# Altium schematic sheet MainPCB.SchDoc: Main PCB
size A4; DrawnBy: Charith Janaka; Engineer: Charith Janaka; Revision: 1; SheetNumber: 1; SheetTotal: 1
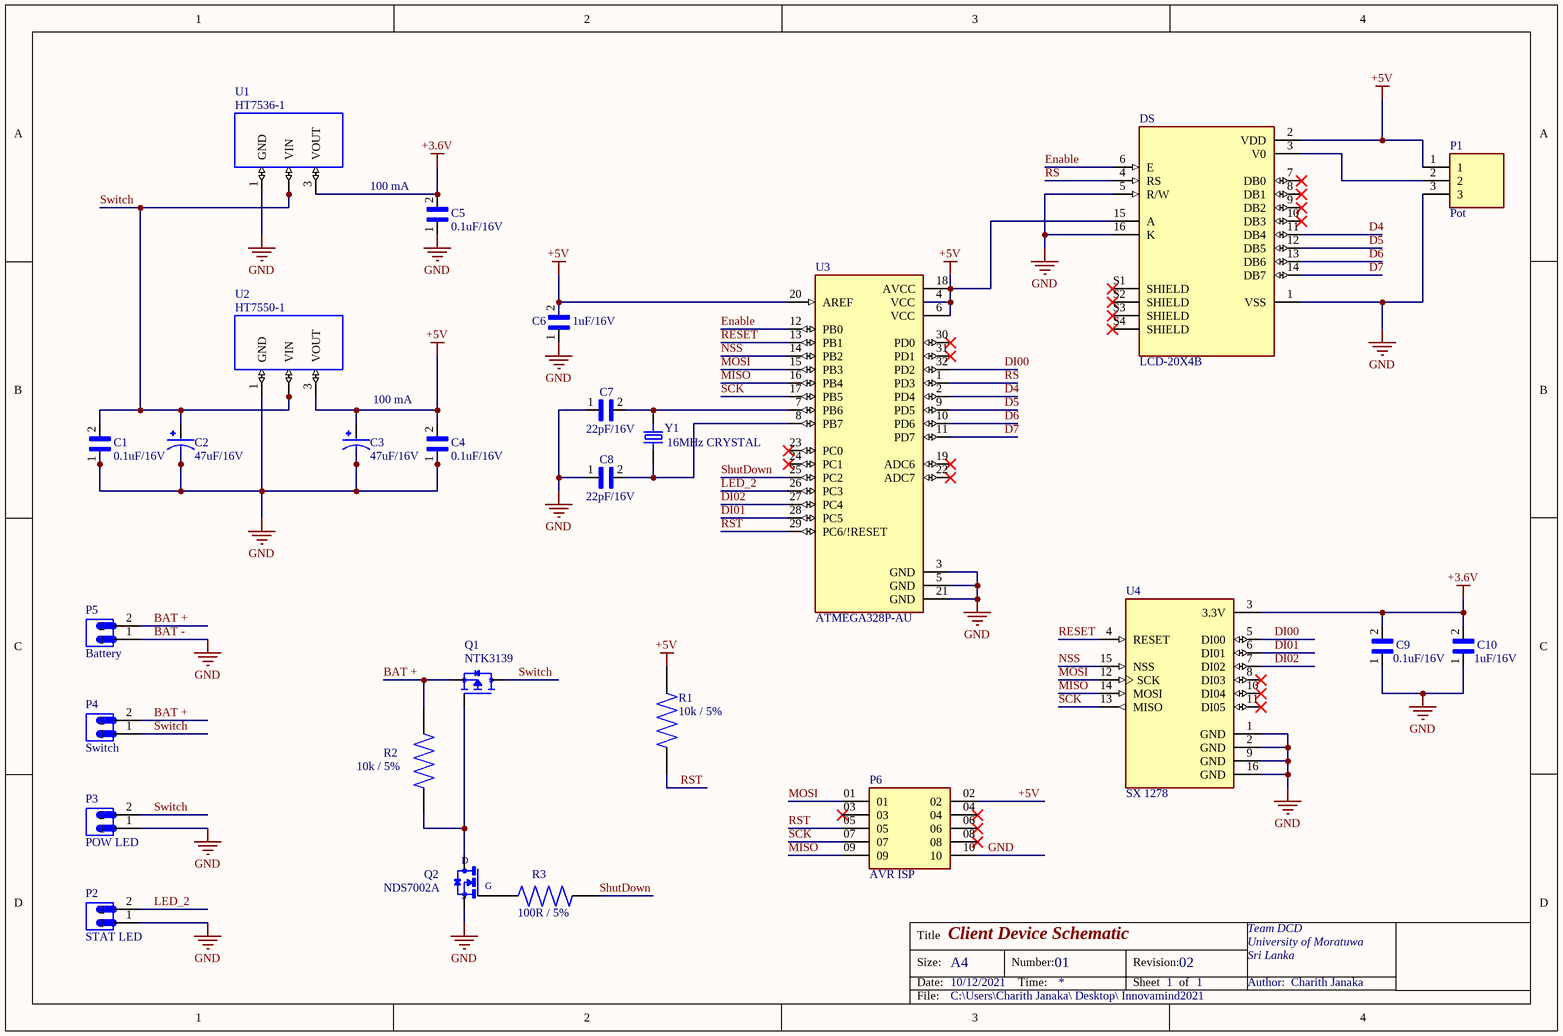
[diagram p0: MainPCB.SchDoc]

## Parts
C1  0.1uF/16V  [CAPC3216X110N]
C2  47uF/16V  [CAP_EEEFC0J470AR]
C3  47uF/16V  [CAP_EEEFC0J470AR]
C4  0.1uF/16V  [CAPC3216X110N]
C5  0.1uF/16V  [CAPC3216X110N]
C6  1uF/16V  [CAPC3316X120N]
C7  22pF/16V  [CAPC3216X88N]
C8  22pF/16V  [CAPC3216X88N]
C9  0.1uF/16V  [CAPC3216X110N]
C10  1uF/16V  [CAPC3316X120N]
DS  LCD-20X4B  [LCD_LCD-20X4B]
P1  Pot  [JST_S3B-XH-A(LF)(SN)]
P2  STAT LED  [JST_S2B-XH-A(LF)(SN)]
P3  POW LED  [JST_S2B-XH-A(LF)(SN)]
P4  Switch  [JST_S2B-XH-A(LF)(SN)]
P5  Battery  [JST_S2B-XH-A(LF)(SN)]
P6  AVR ISP  [SAMTEC_TSW-105-05-L-D]
Q1  NTK3139  [SOT40P120X55-3N]
Q2  NDS7002A  [SOT23]
R1  10k / 5%  [RESC3115X65N]
R2  10k / 5%  [RESC3115X65N]
R3  100R / 5%  [RESC3115X65N]
U1  HT7536-1  [SOT89]
U2  HT7550-1  [SOT89]
U3  ATMEGA328P-AU  [QFP80P900X900X120-32N]
U4  SX 1278  [MODULE_RA-02_LORA]
Y1  16MHz CRYSTAL  [XTAL_ECS-160-20-5PVX]

## Nets
+3.6V: C5.2 C9.2 C10.2 U1.3(VOUT) U4.3(3.3V)
+5V: C3.1 C4.2 C6.2 DS.2(VDD) DS.15(A) P1.1 P6.02 R1.1 U2.3(VOUT) U3.4(VCC) U3.6(VCC) U3.18(AVCC) U3.20(AREF)
BAT -: C1.1 C2.2 C3.2 C4.1 C5.1 C6.1 C7.1 C8.1 C9.1 C10.1 DS.1(VSS) DS.5(R/W) DS.16(K) P1.3 P2.1 P3.1 P5.1 P6.10 Q2.2(S) U1.1(GND) U2.1(GND) U3.3(GND) U3.5(GND) U3.21(GND) U4.1(GND) U4.2(GND) U4.9(GND) U4.16(GND)  [also labelled GND]
BAT +: P4.2 P5.2 Q1.2(S) R2.2
D4: DS.11(DB4) U3.2(PD4)
D5: DS.12(DB5) U3.9(PD5)
D6: DS.13(DB6) U3.10(PD6)
D7: DS.14(DB7) U3.11(PD7)
DI00: U3.32(PD2) U4.5(DI00)
DI01: U3.28(PC5) U4.6(DI01)
DI02: U3.27(PC4) U4.7(DI02)
Enable: DS.6(E) U3.12(PB0)
LED_2: P2.2 U3.26(PC3)
MISO: P6.09 U3.16(PB4) U4.14(MOSI)
MOSI: P6.01 U3.15(PB3) U4.12(SCK)
NSS: U3.14(PB2) U4.15(NSS)
RESET: U3.13(PB1) U4.4(RESET)
RS: DS.4(RS) U3.1(PD3)
RST: P6.05 R1.2 U3.29(PC6/!RESET)
SCK: P6.07 U3.17(PB5) U4.13(MISO)
ShutDown: R3.2 U3.25(PC2)
Switch: C1.2 C2.1 P3.2 P4.1 Q1.3(D) U1.2(VIN) U1.2@1(VIN) U2.2(VIN) U2.2@1(VIN)
NetC7_2: C7.2 U3.7(PB6) Y1.2
NetC8_2: C8.2 U3.8(PB7) Y1.1
NetDS_3: DS.3(V0) P1.2
NetQ1_1: Q1.1(G) Q2.3(D) R2.1
NetQ2_1: Q2.1(G) R3.1

Not connected (* = marked no-connect by the designer): DS 7(DB0)* 8(DB1)* 9(DB2)* 10(DB3)* S1(SHIELD)* S2(SHIELD)* S3(SHIELD)* S4(SHIELD)*; P6 03* 04* 06* 08*; U3 19(ADC6)* 22(ADC7)* 23(PC0)* 24(PC1)* 30(PD0)* 31(PD1)*; U4 8(DI03)* 10(DI04)* 11(DI05)*

## Notes on the sheet
- (near C5) 100 mA
- 100 mA
- Title
- Size:
- Date:
- Client Device Schematic
- 10/12/2021
- A4
- Number:
- Time:
- 01
- Revision:
- Sheet
- 1
- 02
- of
- Team DCD
- University of Moratuwa
- Sri Lanka
- Author:  Charith Janaka
- File:
- C:\Users\Charith Janaka\ Desktop\ Innovamind2021

## Library data of the parts
C1 C4 C5 C9 = C1206F104K4RACAUTO: Package: None; Price: None; Value: *; MP: C1206F104K4RACAUTO; Availability: Unavailable
C2 C3 = EEEFC0J470AR: Cap Aluminum Lytic 47uF 6.3V 20% (5 X 5.4mm) SMD 95mA 1000h 105C Automotive T/R; MF: Panasonic; Package: RADIAL-2 Panasonic; MP: EEEFC0J470AR; Purchase-URL: https://pricing.snapeda.com/search/part/EEEFC0J470AR/?ref=eda; SnapEDA_Link: https://www.snapeda.com/parts/EEEFC0J470AR/Panasonic/view-part/5794427/?ref=snap; Check_prices: https://www.snapeda.com/parts/EEEFC0J470AR/Panasonic/view-part/5794427/?ref=eda; Price: None; Value: *; Availability: In Stock
C6 C10 = C1206X105J4RECAUTO: Package: None; Price: None; Value: *; MP: C1206X105J4RECAUTO; Availability: Unavailable
C7 C8 = C1206C220F4HACAUTO: Package: None; Price: None; Value: *; MP: C1206C220F4HACAUTO; Availability: Unavailable
DS = LCD-20X4B: Display Development Tools 20X4 CHARACTER BLUE LCD W/BACKLIGHT; MF: Gravitech; Price: None; Value: *; Availability: Unavailable; Mouser-Purchase-URL: https://snapeda.com/shop?store=Mouser&id=833821; SnapEDA_Link: https://www.snapeda.com/parts/LCD-20X4B/Gravitech/view-part/833821/?ref=snap; MP: LCD-20X4B; Package: None
P1 = S3B-XH-A(LF)(SN): Connector Header Through Hole, Right Angle 3 position 0.098 _2.50mm_; MP: S3B-XH-A_LF__SN_; MF: JST Sales; SnapEDA_Link: https://www.snapeda.com/parts/S3B-XH-A%28LF%29%28SN%29/JST%20Sales%20America%20Inc./view-part/46873/?ref=snap; Availability: Unavailable; Package: FakePackage u; Value: *; Price: None
P2-P5 = S2B-XH-A(LF)(SN): Connector Header Through Hole, Right Angle 2 position 0.098 _2.50mm_; MP: S2B-XH-A_LF__SN_; MF: JST Sales; Digi-Key_Part_Number: 455-2257-ND; Package: None; Digi-Key_Purchase_URL: https://www.digikey.com/product-detail/en/jst-sales-america-inc/S2B-XH-A_LF__SN_/455-2257-ND/1651055?utm_source=snapeda&utm_medium=aggregator&utm_campaign=symbol; Value: *; SnapEDA_Link: https://www.snapeda.com/parts/S2B-XH-A%28LF%29%28SN%29/JST%20Sales%20America%20Inc./view-part/46871/?ref=snap
P6 = TSW-105-05-L-D: Package: None; Price: None; Value: *; MP: TSW-105-05-L-D; Availability: Unavailable
Q1 = NTK3139PT1G: P-Channel 20V 660mA (Ta) 310mW (Ta) Surface Mount SOT-723; MF: ON Semiconductor; SnapEDA_Link: https://www.snapeda.com/parts/NTK3139PT1G/ON%20Semiconductor/view-part/302649/?ref=snap; Mouser-Purchase-URL: https://snapeda.com/shop?store=Mouser&id=302649; Arrow_Europe-Purchase-URL: https://snapeda.com/shop?store=Arrow+Europe&id=302649; Value: *; Availability: Good; MP: NTK3139PT1G; Price: None; Package: SOT-723 ON Semiconductor; Arrow_Electronics-Purchase-URL: https://snapeda.com/shop?store=Arrow+Electronics&id=302649
Q2 = NDS7002A: N-Channel 60V 280mA _Ta_ 300mW _Ta_ Surface Mount SOT-23 _TO-236AB_; MF: ON Semiconductor; MP: NDS7002A; Availability: Unavailable; SnapEDA_Link: https://www.snapeda.com/parts/NDS7002A/ON%20Semiconductor/view-part/2657545/?ref=snap; Package: SOT-23-3 ON Semiconductor; Price: None; Value: *
R1 = CRGCQ1206J10K: MF: TE Connectivity; DigiKey-Purchase-URL: https://snapeda.com/shop?store=DigiKey&id=3188341; Mouser-Purchase-URL: https://snapeda.com/shop?store=Mouser&id=3188341; Value: *; SnapEDA_Link: https://www.snapeda.com/parts/CRGCQ1206J10K/TE%20Connectivity/view-part/3188341/?ref=snap; Availability: Warning; Price: None; Package: 3115 TE Connectivity; MP: CRGCQ1206J10K
R2 = CRGCQ1206J10K: Fixed Resistor CRGCQ 1206 10K 5%; MF: TE Connectivity; DigiKey-Purchase-URL: https://snapeda.com/shop?store=DigiKey&id=3188341; Mouser-Purchase-URL: https://snapeda.com/shop?store=Mouser&id=3188341; Value: *; SnapEDA_Link: https://www.snapeda.com/parts/CRGCQ1206J10K/TE%20Connectivity/view-part/3188341/?ref=snap; Availability: Warning; Price: None; Package: 3115 TE Connectivity; MP: CRGCQ1206J10K
R3 = CRGCQ1206J100R: Fixed Resistor CRGCQ 1206 100R 5%; Package: None; Price: None; Value: *; MP: CRGCQ1206J100R; Availability: Unavailable
U1 U2 = HT7550-1: Voltage stabiliser; LDO, fixed; 5V; 0.1A; SOT89; SMD; MF: Holtek; Package: None; MP: HT7550-1; Value: *; Price: None; Availability: Unavailable; SnapEDA_Link: https://www.snapeda.com/parts/HT7550-1/Holtek/view-part/586500/?ref=snap
U3 = ATMEGA328P-AU: AVR AVRÂ® ATmega Microcontroller IC 8-Bit 20MHz 32KB _16K x 16_ FLASH 32-TQFP _7x7_; MF: Microchip; Value: *; SnapEDA_Link: https://www.snapeda.com/parts/ATMEGA328P-AU/Microchip/view-part/44280/?ref=snap; MP: ATMEGA328P-AU; Availability: Unavailable; Price: None; Package: TQFP-32 Microchip
U4 = RA-02_LORA: Ra-02 LoRa RF M5Stack Platform Evaluation Expansion Board; MF: AI-Thinker; Package: Package; Availability: Unavailable; Value: *; MP: Ra-02 LoRa; Check_prices: https://www.snapeda.com/parts/Ra-02%20LoRa/AI-Thinker/view-part/4449259/?ref=eda; SnapEDA_Link: https://www.snapeda.com/parts/Ra-02%20LoRa/AI-Thinker/view-part/4449259/?ref=snap; Price: None
Y1 = ECS-160-20-5PVX: 16MHz Â±30ppm Crystal 20pF 50 Ohms HC-49/US; MF: ECS Inc.; Availability: Unavailable; SnapEDA_Link: https://www.snapeda.com/parts/ECS-160-20-5PVX/ECS%20Inc./view-part/2721556/?ref=snap; Package: HC49/US ECS International; MP: ECS-160-20-5PVX; Value: *; Price: None